# EAGLE design GMO-Clone_PCB (EAGLE 9.2.2)
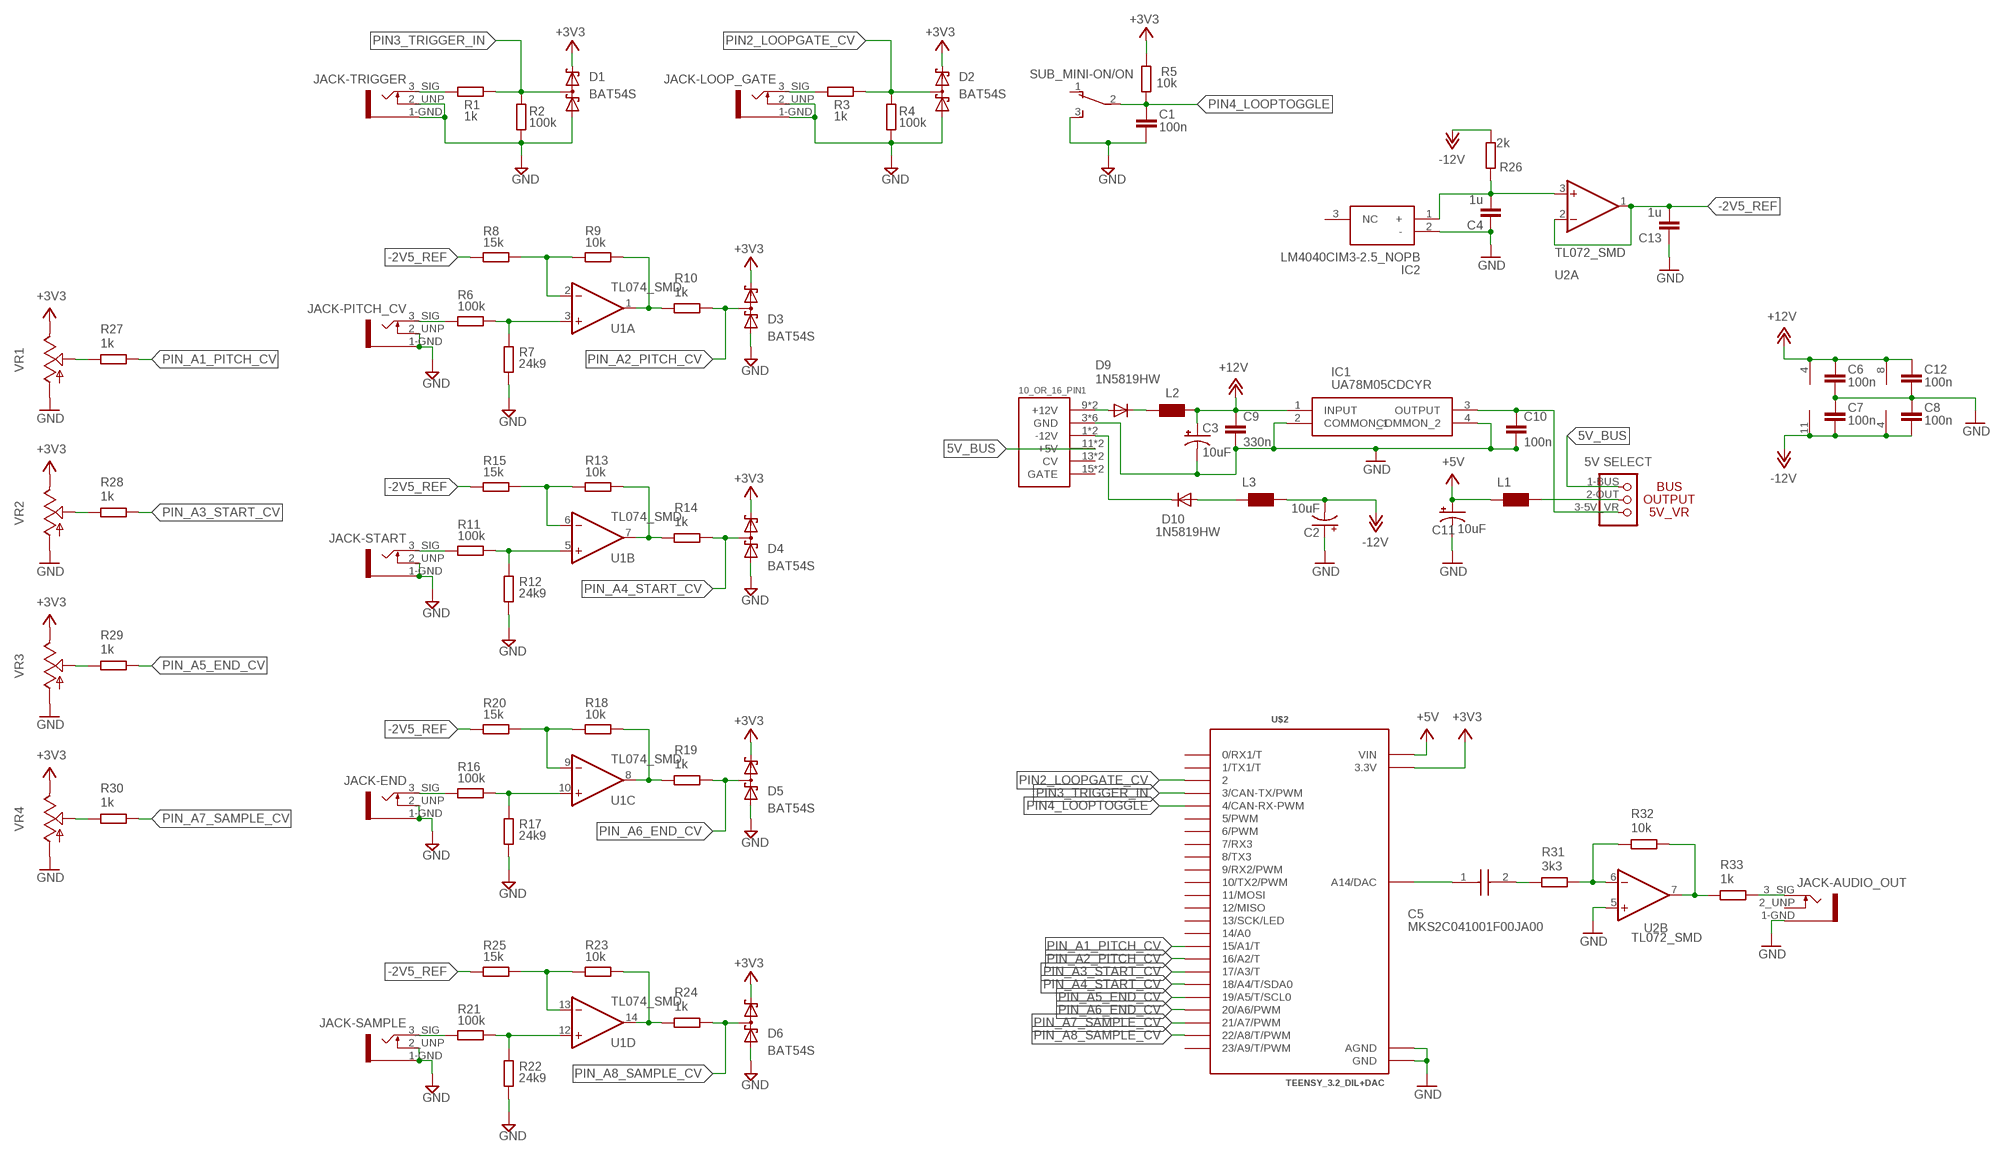
[diagram p0: schematic, sheet 1]

## Parts
10_OR_16_PIN1  POWER  [POWER_16]
C1  100n  C-EUC0603K  [C0603K]
C2  10uF  47UF-POLAR-PANASONIC_D-35V-20%  [PANASONIC_D]
C3  10uF  47UF-POLAR-PANASONIC_D-35V-20%  [PANASONIC_D]
C4  1u  C-EUC0603  [C0603]
C5  MKS2C041001F00JA00  [MKS2C041001F00JA00]
C6  100n  C-EUC0603K  [C0603K]
C7  100n  C-EUC0603K  [C0603K]
C8  100n  C-EUC0603K  [C0603K]
C9  330n  C-EUC0603  [C0603]
C10  100n  C-EUC0603  [C0603]
C11  10uF  47UF-POLAR-PANASONIC_D-35V-20%  [PANASONIC_D]
C12  100n  C-EUC0603K  [C0603K]
C13  1u  C-EUC0603  [C0603]
D1  BAT54S  [SOT23]
D2  BAT54S  [SOT23]
D3  BAT54S  [SOT23]
D4  BAT54S  [SOT23]
D5  BAT54S  [SOT23]
D6  BAT54S  [SOT23]
D9  1N5819HW  DIODE_DIODE-SOD123  [DIODE_SOD123]
D10  1N5819HW  DIODE_DIODE-SOD123  [DIODE_SOD123]
IC1  UA78M05CDCYR  [SOT230P700X180-4N]
IC2  LM4040CIM3-2.5_NOPB  [SOT95P237X112-3N]
JACK-AUDIO_OUT  MISC_JACKTHONK_PJ301M-12  [THONK_PJ301M-12]
JACK-END  MISC_JACKTHONK_PJ301M-12  [THONK_PJ301M-12]
JACK-LOOP_GATE  MISC_JACKTHONK_PJ301M-12  [THONK_PJ301M-12]
JACK-PITCH_CV  MISC_JACKTHONK_PJ301M-12  [THONK_PJ301M-12]
JACK-SAMPLE  MISC_JACKTHONK_PJ301M-12  [THONK_PJ301M-12]
JACK-START  MISC_JACKTHONK_PJ301M-12  [THONK_PJ301M-12]
JACK-TRIGGER  MISC_JACKTHONK_PJ301M-12  [THONK_PJ301M-12]
JP2  SELECTOR_POWER  [SELECTOR_POWER]
L1  WE-CBF_0603  [0603]
L2  WE-CBF_0603  [0603]
L3  WE-CBF_0603  [0603]
R1  1k  R-EU_R0603  [R0603]
R2  100k  R-EU_R0603  [R0603]
R3  1k  R-EU_R0603  [R0603]
R4  100k  R-EU_R0603  [R0603]
R5  10k  R-EU_R0603  [R0603]
R6  100k  R-EU_R0603  [R0603]
R7  24k9  R-EU_R0603  [R0603]
R8  15k  R-EU_R0603  [R0603]
R9  10k  R-EU_R0603  [R0603]
R10  1k  R-EU_R0603  [R0603]
R11  100k  R-EU_R0603  [R0603]
R12  24k9  R-EU_R0603  [R0603]
R13  10k  R-EU_R0603  [R0603]
R14  1k  R-EU_R0603  [R0603]
R15  15k  R-EU_R0603  [R0603]
R16  100k  R-EU_R0603  [R0603]
R17  24k9  R-EU_R0603  [R0603]
R18  10k  R-EU_R0603  [R0603]
R19  1k  R-EU_R0603  [R0603]
R20  15k  R-EU_R0603  [R0603]
R21  100k  R-EU_R0603  [R0603]
R22  24k9  R-EU_R0603  [R0603]
R23  10k  R-EU_R0603  [R0603]
R24  1k  R-EU_R0603  [R0603]
R25  15k  R-EU_R0603  [R0603]
R26  2k  R-EU_R0603  [R0603]
R27  1k  R-EU_R0603  [R0603]
R28  1k  R-EU_R0603  [R0603]
R29  1k  R-EU_R0603  [R0603]
R30  1k  R-EU_R0603  [R0603]
R31  3k3  R-EU_R0603  [R0603]
R32  10k  R-EU_R0603  [R0603]
R33  1k  R-EU_R0603  [R0603]
SUB_MINI-ON/ON  TL36PO  [TL3XPO]
U1  TL074_SMD  [SO14]
U2  TL072_SMD  [SO08]
U$2  TEENSY_3.2_DIL+DAC  [TEENSY_3.2_DIL+DAC]
VR1  9MM_SNAP-IN_POT_  [9MM_SNAP-IN_POT]
VR2  9MM_SNAP-IN_POT_  [9MM_SNAP-IN_POT]
VR3  9MM_SNAP-IN_POT_  [9MM_SNAP-IN_POT]
VR4  9MM_SNAP-IN_POT_  [9MM_SNAP-IN_POT]

## Nets
5V_BUS: 10_OR_16_PIN1.11(+5V) 10_OR_16_PIN1.12(+5V) JP2.1-BUS
+3V3 [power]: D1.2(C2) D2.2(C2) D3.2(C2) D4.2(C2) D5.2(C2) D6.2(C2) R5.2 U$2.3.3V VR1.3(E) VR2.3(E) VR3.3(E) VR4.3(E)
+5V [power]: C11.+ L1.1 U$2.VIN
+12V [power]: C3.+ C6.1 C9.1 C12.1 IC1.1(INPUT) L2.2 U1.4(P:V+) U2.8(P:V+)
-2V5_REF [power]: C13.2 R8.1 R15.1 R20.1 R25.1 U2.1(A:OUT) U2.2(A:-IN)
-12V [power]: C2.- C7.2 C8.2 L3.2 R26.2 U1.11(P:V-) U2.4(P:V-)
GND [power]: 10_OR_16_PIN1.3(GND) 10_OR_16_PIN1.4(GND) 10_OR_16_PIN1.5(GND) 10_OR_16_PIN1.6(GND) 10_OR_16_PIN1.7(GND) 10_OR_16_PIN1.8(GND) C1.2 C2.+ C3.- C4.1 C6.2 C7.1 C8.1 C9.2 C10.2 C11.- C12.2 C13.1 D1.1(A1) D2.1(A1) D3.1(A1) D4.1(A1) D5.1(A1) D6.1(A1) IC1.2(COMMON_1) IC1.4(COMMON_2) IC2.2(-) JACK-AUDIO_OUT.1-GND JACK-END.1-GND JACK-END.2_UNP(2-UNPLUGGED) JACK-LOOP_GATE.1-GND JACK-LOOP_GATE.2_UNP(2-UNPLUGGED) JACK-PITCH_CV.1-GND JACK-PITCH_CV.2_UNP(2-UNPLUGGED) JACK-SAMPLE.1-GND JACK-SAMPLE.2_UNP(2-UNPLUGGED) JACK-START.1-GND JACK-START.2_UNP(2-UNPLUGGED) JACK-TRIGGER.1-GND JACK-TRIGGER.2_UNP(2-UNPLUGGED) R2.1 R4.1 R7.1 R12.1 R17.1 R22.1 SUB_MINI-ON/ON.3(S) U2.5(B:+IN) U$2.AGND U$2.GND VR1.1(A) VR2.1(A) VR3.1(A) VR4.1(A)
N$1: JACK-LOOP_GATE.3_SIG(3-SIGNAL_IN_OUT) R3.1
N$2: JACK-TRIGGER.3_SIG(3-SIGNAL_IN_OUT) R1.1
N$3: JACK-PITCH_CV.3_SIG(3-SIGNAL_IN_OUT) R6.1
N$4: R9.1 R10.2 U1.1(A:OUT)
N$5: R8.2 R9.2 U1.2(A:-IN)
N$6: JACK-START.3_SIG(3-SIGNAL_IN_OUT) R11.1
N$7: R6.2 R7.2 U1.3(A:+IN)
N$8: R13.1 R14.2 U1.7(B:OUT)
N$9: R13.2 R15.2 U1.6(B:-IN)
N$10: R11.2 R12.2 U1.5(B:+IN)
N$11: JACK-END.3_SIG(3-SIGNAL_IN_OUT) R16.1
N$12: R18.1 R19.2 U1.8(C:OUT)
N$13: R18.2 R20.2 U1.9(C:-IN)
N$14: R16.2 R17.2 U1.10(C:+IN)
N$15: JACK-SAMPLE.3_SIG(3-SIGNAL_IN_OUT) R21.1
N$16: R23.1 R24.2 U1.14(D:OUT)
N$17: R23.2 R25.2 U1.13(D:-IN)
N$18: R21.2 R22.2 U1.12(D:+IN)
N$19: R27.2 VR1.2(S)
N$20: R28.2 VR2.2(S)
N$21: R29.2 VR3.2(S)
N$22: R30.2 VR4.2(S)
N$23: C10.1 IC1.3(OUTPUT) JP2.3-5V_VR(3-VR)
N$24: 10_OR_16_PIN1.9(+12V) 10_OR_16_PIN1.10(+12V) D9.A
N$25: C5.1 U$2.RESET/DAC(A14/DAC)
N$26: 10_OR_16_PIN1.1(-12V) 10_OR_16_PIN1.2(-12V) D10.C
N$27: C4.2 IC2.1(+) R26.1 U2.3(A:+IN)
N$28: C5.2 R31.2
N$29: R31.1 R32.2 U2.6(B:-IN)
N$30: R32.1 R33.2 U2.7(B:OUT)
N$31: JACK-AUDIO_OUT.3_SIG(3-SIGNAL_IN_OUT) R33.1
N$32: JP2.2-OUT L1.2
N$33: D9.C L2.1
N$34: D10.A L3.1
PIN2_LOOPGATE_CV: D2.3(C1A2) R3.2 R4.2 U$2.2
PIN3_TRIGGER_IN: D1.3(C1A2) R1.2 R2.2 U$2.3(3/CAN-TX/PWM)
PIN4_LOOPTOGGLE: C1.1 R5.1 SUB_MINI-ON/ON.2(P) U$2.4(4/CAN-RX-PWM)
PIN_A1_PITCH_CV: R27.1 U$2.15/A1(15/A1/T)
PIN_A2_PITCH_CV: D3.3(C1A2) R10.1 U$2.16/A2(16/A2/T)
PIN_A3_START_CV: R28.1 U$2.17/A3(17/A3/T)
PIN_A4_START_CV: D4.3(C1A2) R14.1 U$2.18/A4(18/A4/T/SDA0)
PIN_A5_END_CV: R29.1 U$2.19/A5(19/A5/T/SCL0)
PIN_A6_END_CV: D5.3(C1A2) R19.1 U$2.20/A6(20/A6/PWM)
PIN_A7_SAMPLE_CV: R30.1 U$2.21/A7(21/A7/PWM)
PIN_A8_SAMPLE_CV: D6.3(C1A2) R24.1 U$2.22/A8(22/A8/T/PWM)
Unconnected: 10_OR_16_PIN1.13(CV) 10_OR_16_PIN1.14(CV) 10_OR_16_PIN1.15(GATE) 10_OR_16_PIN1.16(GATE) IC2.3(NC) JACK-AUDIO_OUT.2_UNP(2-UNPLUGGED) SUB_MINI-ON/ON.1(O) U$2.0(0/RX1/T) U$2.1(1/TX1/T) U$2.5(5/PWM) U$2.6(6/PWM) U$2.7(7/RX3) U$2.8(8/TX3) U$2.9(9/RX2/PWM) U$2.10(10/TX2/PWM) U$2.11(11/MOSI) U$2.12(12/MISO) U$2.13(13/SCK/LED) U$2.14/A0 U$2.23/A9(23/A9/T/PWM)

## Library data of the parts
10_OR_16_PIN1 = eurorack:POWER
C1 C4 C6-C10 C12 C13 = resistor:C-EU: CAPACITOR, European symbol
C2 C3 C11 = SparkFun-Capacitors:47UF-POLAR: 47µF polarized capacitors A capacitor is a passive two-terminal electrical component used to store electrical energy temporarily in an electric field.; PROD_ID: CAP-08478; VALUE: 47uF
C5 = SamacSys_Parts:MKS2C041001F00JA00: Film Capacitors 1.0 uF 63 VDC 5% Source: Datasheet <https://componentsearchengine.com/Datasheets/1/MKS2C041001F00JA00.pdf>; DESCRIPTION: Film Capacitors 1.0 uF 63 VDC 5%; HEIGHT: 10mm; MANUFACTURER_NAME: WIMA; MANUFACTURER_PART_NUMBER: MKS2C041001F00JA00; MOUSER_PART_NUMBER: 505-MKS2C041001F00JA; MOUSER_PRICE-STOCK: https://www.mouser.com/Search/Refine.aspx?Keyword=505-MKS2C041001F00JA
D1-D6 = diode:BAT54S: Schottky Diodes Pin connection corrected 2011-05-04 Source: Fairchild .. BAT54.pdf
D9 D10 = grids_v02:DIODE_DIODE-: DIODE
IC1 = SamacSys_Parts:UA78M05CDCYR: 500-mA, 25-V, Linear Voltage Regulators Source: Datasheet <http://www.ti.com/lit/gpn/ua78m>; DESCRIPTION: 500-mA, 25-V, Linear Voltage Regulators; HEIGHT: 1.8mm; MANUFACTURER_NAME: Texas Instruments; MANUFACTURER_PART_NUMBER: UA78M05CDCYR; MOUSER_PART_NUMBER: 595-UA78M05CDCYR; MOUSER_PRICE-STOCK: https://www.mouser.com/Search/Refine.aspx?Keyword=595-UA78M05CDCYR
IC2 = SamacSys_Parts:LM4040CIM3-2.5_NOPB: 100-ppm/C precision micropower shunt voltage reference Source: Datasheet <http://www.ti.com/lit/ds/symlink/lm4040-n.pdf>; DESCRIPTION: 100-ppm/C precision micropower shunt voltage reference; HEIGHT: 1.12mm; MANUFACTURER_NAME: Texas Instruments; MANUFACTURER_PART_NUMBER: LM4040CIM3-2.5/NOPB; MOUSER_PART_NUMBER: 926-LM4040CIM325NOPB; MOUSER_PRICE-STOCK: https://www.mouser.com/Search/Refine.aspx?Keyword=926-LM4040CIM325NOPB; RS_PART_NUMBER: 5359600P; RS_PRICE-STOCK: http://uk.rs-online.com/web/p/products/5359600P
JACK-AUDIO_OUT JACK-END JACK-LOOP_GATE JACK-PITCH_CV JACK-SAMPLE JACK-START JACK-TRIGGER = SchnitzelsComponents:MISC_JACK: 3.5mm Mono Switching Jack Part-Nr.: PJ301BM Supplier: - www.Thonk.uk Link to Jacks @ Thonk.uk <https://www.thonk.co.uk/shop/3-5mm-jacks/>
JP2 = SchnitzelsComponents:SELECTOR_POWER: PIN HEADER
L1-L3 = wuerth-elektronik:WE-CBF: SMD EMI Suppression Ferrite Beads - excellent anti-EMI properties - low DCR - impedances till 3000 ohms - rated current up to 6 A
R1-R33 = resistor:R-EU_: RESISTOR, European symbol
SUB_MINI-ON/ON = switch:TL36PO: TINY SWITCH ON - ON Source: http://www2.produktinfo.conrad.com/datenblaetter/700000-724999/705152-da-01-de-Subminiaturschalter_TL_36YO.pdf
U1 = MusicThingModular:TL074: Generic Quad Op Amp
U2 = MusicThingModular:TL072: Generic Dual Op Amp
U$2 = SchnitzelsComponents:TEENSY_3.2_DIL+DAC: Footprint for Teensy 3.1 or 3.2 board using all pin connections on the outer perimeter
VR1-VR4 = MusicThingModular:9MM_SNAP-IN_POT: 9mm vertical snap-in pot, Alpha / Panasonic style

## Net classes
0 default: width 0.305 mm, clearance 0.305 mm
1 power: width 0.508 mm, clearance 0.508 mm

## Board
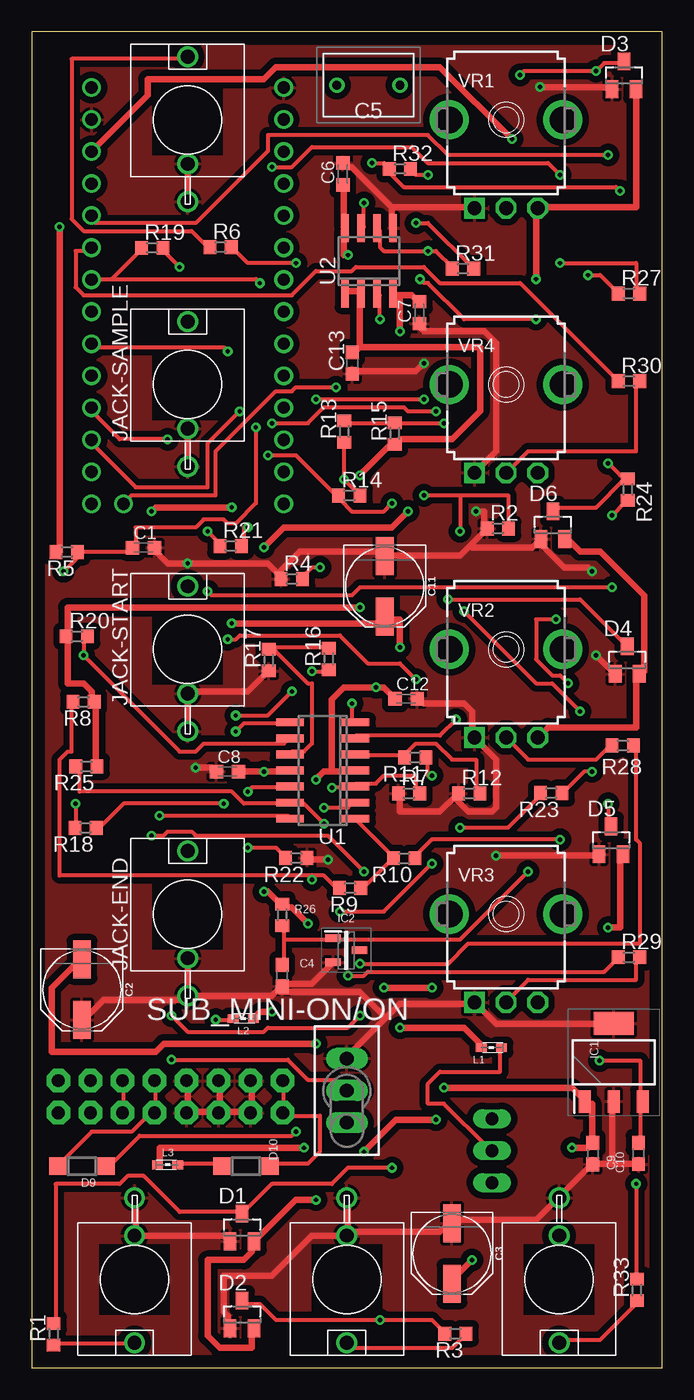
[diagram p1: board, top side]
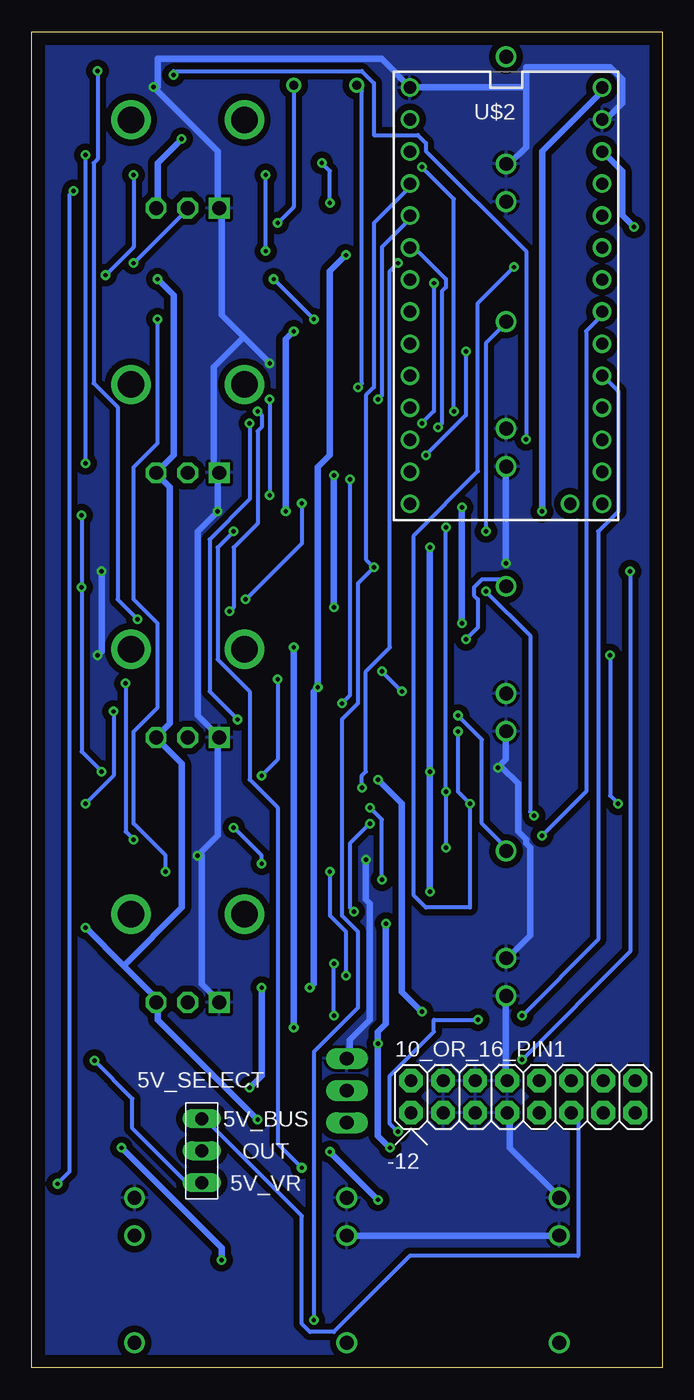
[diagram p2: board, bottom side, seen from below]

Size 50 x 106 mm. Coordinates in mm from the lower left corner, seen from the top.
Outline: 0,0 50,0 50,106 0,106 0,0
Copper layers (1*16): Top 0.035mm / dielectric 1.5mm / Bottom 0.035mm
Design rules "default": minimum track width 6mil, minimum drill 0.35mm, track to track 6mil, track to pad 6mil, pad to pad 6mil, via to via 6mil, smd to smd 6mil, copper to edge 40mil, drill to drill 6mil, minimum pad ring 10mil, minimum via ring 8mil, stop-mask expansion 4mil, vias tented up to drill 0mil, thermal gap 10mil

### Footprints (pad centres in the part's own frame; a part is rotated, then mirrored left to right if it is on the bottom)
POWER_16 = drill 1.016 pad 1.88 octagon: 1 -6.35,-1.27; 2 -6.35,1.27; 3 -3.81,-1.27; 4 -3.81,1.27; 5 -1.27,-1.27; 6 -1.27,1.27; 7 1.27,-1.27; 8 1.27,1.27; 9 3.81,-1.27; 10 3.81,1.27; 11 6.35,-1.27; 12 6.35,1.27; 13 8.89,-1.27; 14 8.89,1.27; 15 11.43,-1.27; 16 11.43,1.27
C0603K = smd 1.05 x 1.08: 1 -0.875,0; 2 0.875,0
PANASONIC_D = smd 3 x 1.4: + 2.4,0; - -2.4,0
C0603 = smd 1.1 x 1: 1 -0.85,0; 2 0.85,0
MKS2C041001F00JA00 = drill 0.7 pad 1.2: 1 0,0; 2 5,0
SOT23 = smd 1 x 1.4: 1 -0.95,-1.1; 2 0.95,-1.1; 3 0,1.1
DIODE_SOD123 = smd 1.4 x 1.4: A 1.9,0; C -1.9,0
SOT230P700X180-4N = smd 1.8 x 0.95: 1 -3.1,2.3; 2 -3.1,0; 3 -3.1,-2.3 | smd 1.8 x 3.2: 4 3.1,0
SOT95P237X112-3N = smd 1.25 x 0.6: 1 -1.05,0.95; 2 -1.05,-0.95; 3 1.05,0
THONK_PJ301M-12 = drill 1.1: 1-GND 0,-6.5; 2_UNP 0,-3.5; 3_SIG 0,5
SELECTOR_POWER = drill 1.016 long: 1-BUS 0,5.08; 2-OUT 0,2.54; 3-5V_VR 0,0
0603 = smd 0.85 x 0.7: 1 -0.9,0; 2 0.7,0
R0603 = smd 1 x 1.1: 1 -0.85,0; 2 0.85,0
TL3XPO = drill 1.1 pad 1.422 long: 1 -2.54,0; 2 0,0; 3 2.54,0
SO14 = smd 0.6 x 2.2: 1 -3.81,-2.6; 2 -2.54,-2.6; 3 -1.27,-2.6; 4 0,-2.6; 5 1.27,-2.6; 6 2.54,-2.6; 7 3.81,-2.6; 8 3.81,2.6; 9 2.54,2.6; 10 1.27,2.6; 11 0,2.6; 12 -1.27,2.6; 13 -2.54,2.6; 14 -3.81,2.6
SO08 = smd 0.6 x 2.2: 1 -1.905,-2.6; 2 -0.635,-2.6; 3 0.635,-2.6; 4 1.905,-2.6; 5 1.905,2.6; 6 0.635,2.6; 7 -0.635,2.6; 8 -1.905,2.6
TEENSY_3.2_DIL+DAC = drill 0.965: 0 -7.62,13.97; 1 -7.62,11.43; 2 -7.62,8.89; 3 -7.62,6.35; 3.3V 7.62,11.43; 4 -7.62,3.81; 5 -7.62,1.27; 6 -7.62,-1.27; 7 -7.62,-3.81; 8 -7.62,-6.35; 9 -7.62,-8.89; 10 -7.62,-11.43; 11 -7.62,-13.97; 12 -7.62,-16.51; 13 7.62,-16.51; 14/A0 7.62,-13.97; 15/A1 7.62,-11.43; 16/A2 7.62,-8.89; 17/A3 7.62,-6.35; 18/A4 7.62,-3.81; 19/A5 7.62,-1.27; 20/A6 7.62,1.27; 21/A7 7.62,3.81; 22/A8 7.62,6.35; 23/A9 7.62,8.89; AGND 7.62,13.97; GND -7.62,16.51; RESET/DAC 5.08,-16.51; VIN 7.62,16.51
9MM_SNAP-IN_POT = drill 1.1 square: 1 -2.5,-7 | drill 1.1 octagon: 2 0,-7; 3 2.5,-7 | drill 2.1 pad 2.794: CHASSIS1 -4.5,0; CHASSIS2 4.5,0

### Placement (x,y rotation side)
10_OR_16_PIN1  13.56,21.52 0 bottom
C1  8.88,65.07 0 top
C2  4,30 270 top
C3  33.34,9.08 270 top
C4  19.87,31.13 90 top
C5  24.21,101.75 0 top
C6  24.68,94.7 90 top
C7  30.76,83.7 90 top
C8  15.53,47.3 0 top
C9  44.5,17 270 top
C10  48.12,17.02 270 top
C11  28,62 270 top
C12  29.7,53.08 0 top
C13  25.43,79.7 90 top
D1  16.7,11.15 0 top
D2  16.7,4.25 0 top
D3  46.98,102.52 0 top
D4  47.23,56.15 0 top
D5  45.95,41.85 0 top
D6  41.33,66.85 0 top
D9  4,16 180 top
D10  17,16 180 top
IC1  46.16,24.23 90 top
IC2  24.95,33.13 0 top
JACK-AUDIO_OUT  41.83,7 180 top
JACK-END  12.38,36 0 top
JACK-LOOP_GATE  25,7 180 top
JACK-PITCH_CV  12.38,99 0 top
JACK-SAMPLE  12.38,78 0 top
JACK-START  12.38,57 0 top
JACK-TRIGGER  8.17,7 180 top
JP2  36.51,14.69 0 bottom
L1  36.56,25.41 0 top
L2  16.89,27.71 0 top
L3  10.69,16.12 180 top
R1  1.75,2.68 90 top
R2  36.98,66.58 0 top
R3  33.61,2.72 180 top
R4  20.63,62.58 0 top
R5  2.8,64.72 180 top
R6  14.99,88.9 0 top
R7  29.93,45.58 0 top
R8  4.13,52.84 180 top
R9  25.26,38.07 180 top
R10  29.55,40.43 180 top
R11  30.42,48.42 180 top
R12  34.71,45.58 0 top
R13  24.8,74.28 90 top
R14  25.2,69.2 0 top
R15  28.8,74.12 90 top
R16  23.56,56.24 90 top
R17  18.8,56.14 90 top
R18  4.29,42.84 180 top
R19  9.56,88.84 0 top
R20  3.6,58.03 0 top
R21  15.79,65.2 0 top
R22  20.99,40.45 180 top
R23  41.21,45.59 180 top
R24  47.28,69.67 270 top
R25  4.35,47.72 180 top
R26  19.87,35.94 90 top
R27  47.37,85.22 0 top
R28  46.88,49.37 180 top
R29  47.37,32.58 0 top
R30  47.37,78.26 0 top
R31  34.21,87.18 0 top
R32  29.21,95.1 0 top
R33  48,6.19 90 top
SUB_MINI-ON/ON  25,22 90 top
U1  23.09,47.39 90 top
U2  26.75,87.8 0 top
U$2  12.38,85.05 0 bottom
VR1  37.62,99 0 top
VR2  37.62,57 0 top
VR3  37.62,36 0 top
VR4  37.62,78 0 top

### Tracks (layer width: path | path; a pad name or v marks a point on that pad's centre or on a via)
5V_BUS
  Top 0.305: 10_OR_16_PIN1.12 7.3,22.54 7.3,20.32 10_OR_16_PIN1.11
  Bottom 0.305: JP2.1-BUS 36.2,19.68 28.57,12.06 28.57,3.49 27.94,2.86 26.04,2.86 20,8.89 6.67,8.89 6.67,19.68 6.99,20 10_OR_16_PIN1.11
+3V3  (via drill 0.35)
  Top 0.508: D2.2 17.46,2.86 17.46,1.59 14.92,1.59 13.97,2.54 13.97,8.57 16.83,8.57 17.46,9.21 17.46,9.84 D1.2 17.78,10.16 20.95,13.34 v22.54,13.34 | v45.72,34.92 46.67,34.92 46.67,40.64 D5.2 | v26.35,17.14 28.89,19.68 v32.07,19.68 | v2.22,90.49 2.22,64.77 R5.2 | D3.2 47.94,101.28 47.94,92.08 40.32,92.08 VR1.3 40.01,91.76 v40.01,86.36 | VR2.3 40.32,50.16 40.96,50.8 47.94,50.8 47.94,54.93 D4.2 48.26,55.24 48.58,55.24 48.58,61.28 45.09,64.77 43.5,64.77 42.55,65.72 D6.2 | v38.1,97.47 32.38,103.19 19.37,103.19 18.41,102.23 9.21,102.23 9.21,100.97 4.76,96.52 U$2.3.3V
  Bottom 0.508: 42.7,31.91 40.32,29.53 40.32,29.21 VR3.3 40.01,28.89 40.01,27.62 v32.07,19.68 | 42.7,31.91 v45.72,34.92 | v26.35,17.14 v22.54,13.34 | v2.22,90.49 3.17,91.44 3.17,94.93 4.45,96.2 U$2.3.3V | v40.01,86.36 38.73,85.09 38.73,72.39 VR4.3 40.01,70.8 39.05,69.85 39.05,51.12 40.01,50.16 VR2.3 40.01,49.85 38.1,47.94 38.1,36.51 42.7,31.91 | v38.1,97.47 40.01,95.57 40.01,92.08 VR1.3
+5V  (via drill 0.35)
  Top 0.508: v29.21,26.99 34.29,26.99 35.56,25.72 L1.1 | 29.21,59.05 29.21,59.37 28.26,59.37 C11.+ | 29.21,59.05 v29.21,57.15 | v9.53,67.94 9.84,68.26 v15.88,68.26 | 29.21,59.05 v15.88,59.05
  Bottom 0.508: v29.21,57.15 v29.21,26.99 | v9.53,67.94 9.53,96.52 4.76,101.28 U$2.VIN | v15.88,59.05 v15.88,68.26
+12V  (via drill 0.35)
  Top 0.508: v42.86,17.46 44.13,17.46 44.45,17.78 C9.1 44.45,18.1 44.45,20.95 44.13,20.95 IC1.1 43.81,21.27 42.86,22.23 v32.7,22.23 | v34.92,8.57 33.34,6.99 C3.+ | C6.1 24.77,93.66 24.77,90.49 U2.8 24.77,90.17 24.77,88.27 v25.08,88.27 | v19.05,28.26 18.1,28.26 17.78,27.94 L2.2 | v22.54,46.67 23.18,47.31 23.81,47.31 | 23.81,47.31 25.4,47.31 U1.4 | 23.81,47.31 23.81,53.02 24.77,53.98 v27.3,53.98 27.94,53.98 28.57,53.34 C12.1 | v27.94,30.16 v31.75,30.16
  Bottom 0.508: v42.86,17.46 34.92,9.53 v34.92,8.57 | v19.05,28.26 20.64,29.84 20.64,44.77 v22.54,46.67 | v25.08,88.27 26.35,87 26.35,72.39 27.3,71.44 v27.3,53.98 27.62,53.66 27.62,30.48 v27.94,30.16 | v32.7,22.23 31.75,23.18 v31.75,30.16
-2V5_REF  (via drill 0.35)
  Top 0.508: R25.1 5.08,47.94 5.08,52.7 R8.1 4.76,53.02 4.76,53.66 4.13,54.29 2.86,54.29 2.86,57.78 R20.1 2.86,58.1 2.86,60.33 v26.04,60.33 | U2.1 25.08,85.41 26.04,85.41 U2.2 26.04,85.09 26.04,80.96 | 26.04,80.96 35.56,80.96 35.56,75.88 33.34,73.66 29.21,73.66 28.89,73.34 R15.1 28.57,73.03 28.26,73.03 v26.04,70.8 | 26.04,80.96 25.72,80.64 C13.2
  Bottom 0.508: v26.04,70.8 v26.04,60.33
-12V  (via drill 0.35)
  Top 0.508: v21.59,17.46 10.16,17.46 10.16,16.19 L3.2 | v21.91,35.24 20.64,36.51 20,36.51 R26.2 19.68,36.83 18.73,37.78 v18.41,37.78 | v22.54,25.72 10.48,25.72 9.84,25.08 1.59,25.08 1.59,30.16 3.81,32.38 C2.- | 29.21,85.09 28.89,85.09 U2.4 | 29.21,85.09 30.16,85.09 30.48,84.77 C7.2 | C8.2 16.51,47.31 v18.41,47.31 20.32,47.31 U1.11 | v29.21,82.23 29.21,85.09 | v29.84,67.94 28.57,66.67 20,66.67 v18.41,65.09
  Bottom 0.508: v21.59,17.46 22.54,18.41 v22.54,25.72 22.54,26.67 21.91,27.3 v21.91,35.24 | v29.21,82.23 29.84,81.6 v29.84,67.94 | v18.41,65.09 v18.41,47.31 v18.41,37.78
GND  (via drill 0.35)
  Top 0.508: JACK-SAMPLE.1-GND 12.38,71.75 12.38,74.3 JACK-SAMPLE.2_UNP | 19.53,63.02 19.68,62.87 R4.1 | 19.53,63.02 18.73,63.82 v12.38,63.82 10.79,63.82 9.84,64.77 C1.2 | 34.77,65.25 33.97,64.45 28.26,64.45 C11.- 27.94,64.45 27.62,64.77 21.27,64.77 19.53,63.02 | 34.77,65.25 35.88,66.36 R2.1 35.88,66.67 35.88,67.94 v35.24,67.94 | 34.77,65.25 34.92,65.09 39.69,65.09 40.32,65.72 D6.1 40.32,65.41 42.23,63.5 44.13,63.5 v44.45,63.18 | v44.77,56.52 46.04,55.24 D4.1 | JACK-PITCH_CV.1-GND 12.38,92.71 12.38,95.25 JACK-PITCH_CV.2_UNP | C7.1 30.8,82.55 31.11,82.23 35.88,82.23 36.83,81.28 36.83,72.71 35.24,71.12 VR4.1 | 28.57,92.08 25.4,95.25 25.08,95.25 24.77,95.57 C6.2 | 28.57,92.08 28.57,90.49 U2.5 | v31.11,79.69 30.48,79.06 25.72,79.06 C13.1 | v40.32,101.6 45.72,101.6 D3.1 | 28.57,92.08 34.92,92.08 VR1.1 | v23.5,40.32 21.91,40.32 R22.1 | IC1.4 46.04,27.3 36.83,27.3 35.24,28.89 VR3.1 34.92,28.89 29.21,28.89 28.1,27.78 | R7.1 29.21,45.4 29.21,44.13 32.38,44.13 33.66,45.4 R12.1 33.66,45.09 34.61,44.13 36.51,44.13 36.83,44.45 36.83,48.26 35.24,49.85 VR2.1 34.92,50.16 34.92,52.07 34.29,52.7 31.11,52.7 30.8,53.02 C12.2 | v36.83,40.64 44.77,40.64 D5.1 | 28.1,27.78 25.08,24.77 SUB_MINI-ON/ON.3 | 46.04,16.19 47.94,16.19 C10.2 | 46.04,16.19 44.77,16.19 C9.2 44.45,15.88 44.13,15.88 41.91,13.65 JACK-AUDIO_OUT.1-GND 41.59,13.34 40.01,11.75 33.34,11.75 C3.- 33.02,11.43 32.38,10.79 25.08,10.79 | 46.04,16.19 46.04,20.95 IC1.2 | D2.1 15.56,3.17 15.56,4.13 15.24,4.45 15.24,7.3 19.05,7.3 22.23,10.48 24.77,10.48 JACK-LOOP_GATE.2_UNP 25.08,10.79 | 25.08,10.79 25.08,13.34 JACK-LOOP_GATE.1-GND
  Top 0.508: v13.02,47.62 14.29,47.62 14.61,47.31 C8.1 | R17.1 18.73,55.24 17.14,53.66 12.38,53.66 JACK-START.2_UNP 12.38,53.34 12.38,50.8 JACK-START.1-GND | D1.1 15.56,10.16 15.24,10.48 8.26,10.48 JACK-TRIGGER.2_UNP 8.26,10.79 8.26,13.34 JACK-TRIGGER.1-GND | 10_OR_16_PIN1.4 17.46,22.54 17.46,20.32 10_OR_16_PIN1.3 17.14,20.32 14.92,20.32 | 12.38,20.32 12.38,22.54 10_OR_16_PIN1.8 | 14.92,20.32 14.92,22.54 10_OR_16_PIN1.6 | 12.38,20.32 14.61,20.32 10_OR_16_PIN1.5 14.92,20.32 | 12.38,20.32 10_OR_16_PIN1.7 | 12.38,29.53 19.05,29.53 19.68,30.16 C4.1 | IC2.2 23.81,32.07 22.23,30.48 20,30.48 C4.1 | C2.+ 4.13,27.62 5.71,29.21 12.06,29.21 JACK-END.1-GND 12.38,29.53 | 12.38,29.53 12.38,32.38 JACK-END.2_UNP | 28.1,27.78 26.04,29.84 19.68,29.84 C4.1
  Bottom 0.508: v12.38,63.82 12.38,71.44 JACK-SAMPLE.1-GND | v44.77,56.52 44.45,56.83 v44.45,63.18 | 10.79,101.6 10.79,96.84 12.06,95.57 JACK-PITCH_CV.2_UNP | 10.79,101.6 10.79,103.19 4.13,103.19 3.17,102.23 3.17,100.33 4.45,99.06 U$2.AGND | 10.79,101.6 19.68,101.6 U$2.GND 20,101.6 22.23,103.82 40.01,103.82 40.01,101.6 v40.32,101.6 35.24,96.52 35.24,92.08 VR1.1 34.92,91.76 34.92,83.5 33.18,81.76 | 33.18,81.76 v31.11,79.69 | 33.18,81.76 35.56,79.38 35.56,71.44 35.24,71.12 VR4.1 35.24,70.8 v35.24,67.94 36.83,66.36 36.83,51.75 35.24,50.16 VR2.1 35.24,49.85 35.24,42.23 v36.83,40.64 36.51,40.64 36.51,30.48 35.24,29.21 VR3.1 | v23.5,40.32 23.5,37.15 23.18,36.83 23.18,27.62 24.77,26.04 24.77,24.77 SUB_MINI-ON/ON.3 | JACK-START.1-GND 12.38,50.48 12.38,48.26 v13.02,47.62 12.7,47.62 11.43,46.35 11.43,42.55 10.79,41.91 10.79,41.59 10.48,41.27 10.48,34.29 12.06,32.7 JACK-END.2_UNP | 10_OR_16_PIN1.8 12.38,22.86 12.38,29.21 JACK-END.1-GND | JACK-TRIGGER.1-GND 8.26,13.65 12.06,17.46 12.06,20 10_OR_16_PIN1.7 | JACK-LOOP_GATE.2_UNP 24.77,10.48 8.26,10.48 JACK-TRIGGER.2_UNP
  pour Top: 1,105 49,105 49,1 1,1
  pour Bottom: 1,105 49,105 49,1 1,1
N$1
  Top 0.305: R3.1 34.29,2.54 33.34,1.59 25.4,1.59 25.08,1.91 JACK-LOOP_GATE.3_SIG
N$2
  Top 0.305: R1.1 1.91,1.91 7.94,1.91 JACK-TRIGGER.3_SIG
N$3
  Top 0.305: R6.1 13.97,88.9 12.7,90.17 4.13,90.17 3.17,91.12 3.17,103.82 12.06,103.82 JACK-PITCH_CV.3_SIG
N$4
  Top 0.305: R9.1 26.35,38.1 28.57,40.32 R10.2 28.57,40.64 25.72,43.5 U1.1
N$5  (via drill 0.35)
  Top 0.305: 22.23,39.05 23.18,39.05 24.13,38.1 R9.2 | 22.23,39.05 2.22,39.05 2.22,48.26 2.86,48.9 3.17,48.9 3.17,52.7 R8.2 | v23.18,44.45 25.08,44.45 25.4,44.77 U1.2 | 22.23,39.05 v22.23,38.73
  Bottom 0.305: v23.18,44.45 22.23,43.5 v22.23,38.73
N$6  (via drill 0.35)
  Top 0.305: v31.75,46.99 31.43,46.99 31.43,48.26 R11.1 | v30.48,54.61 29.21,55.88 26.67,55.88 24.45,58.1 16.51,58.1 16.19,57.78 v15.56,57.78
  Bottom 0.305: v31.75,46.99 30.48,48.26 v30.48,54.61 | v15.56,57.78 14.61,58.74 14.61,60.96 14.92,61.28 14.92,61.91 14.29,62.55 12.38,62.55 12.38,62.23 JACK-START.3_SIG
N$7  (via drill 0.35)
  Top 0.305: v20.95,87.63 17.14,87.63 15.88,88.9 R6.2 | v23.81,46.04 25.4,46.04 U1.3 25.72,46.35 27.3,46.35 27.94,46.99 30.48,46.99 30.48,45.72 R7.2
  Bottom 0.305: v20.95,87.63 21.59,87 21.59,57.15 23.5,55.24 23.5,47.31 23.81,46.99 v23.81,46.04
N$8  (via drill 0.35)
  Top 0.305: R14.2 v24.77,70.48 24.77,73.34 R13.1 | v25.4,52.7 25.4,51.44 U1.7
  Bottom 0.305: v25.4,52.7 24.77,53.34 v24.77,70.48
N$9  (via drill 0.35)
  Top 0.305: R13.2 25.08,74.93 28.57,74.93 R15.2 28.89,74.93 v32.7,74.93 | v33.66,51.44 32.38,50.16 25.72,50.16 U1.6
  Bottom 0.305: v33.66,51.44 35.88,53.66 35.88,65.72 32.7,68.9 v32.7,74.93
N$10
  Top 0.305: 29.53,48.58 30.48,49.53 32.07,49.53 33.34,48.26 35.24,48.26 35.24,45.72 R12.2 | 29.53,48.58 25.72,48.58 U1.5 | 29.53,48.58 R11.2
N$11  (via drill 0.35)
  Top 0.305: v22.23,55.24 23.5,55.24 R16.1 | v20.64,53.66 18.73,51.75 v16.19,51.75
  Bottom 0.305: v20.64,53.66 v22.23,55.24 | v16.19,51.75 14.29,49.85 14.29,43.18 12.38,41.27 JACK-END.3_SIG
N$12  (via drill 0.35)
  Top 0.305: v15.24,44.77 7.3,44.77 5.4,42.86 R18.1 | v16.19,50.48 16.83,51.12 20.32,51.12 U1.8 | v11.75,87.31 10.48,88.58 R19.2
  Bottom 0.305: v16.19,50.48 16.19,45.72 v15.24,44.77 15.24,36.51 18.73,36.51 19.68,37.47 19.68,66.04 14.61,71.12 14.61,84.45 v11.75,87.31
N$13  (via drill 0.35)
  Top 0.305: v3.49,44.77 3.49,42.86 R18.2 | R20.2 4.45,57.78 4.13,57.78 v4.13,56.52 11.75,48.9 13.02,48.9 13.65,49.53 20,49.53 20.32,49.85 U1.9
  Bottom 0.305: v3.49,44.77 4.13,45.4 v4.13,56.52
N$14
  Top 0.305: R16.2 23.5,57.15 19.05,57.15 R17.2 19.05,56.83 19.37,56.83 21.91,54.29 22.23,54.29 22.23,49.53 21.59,48.9 20.64,48.9 U1.10
N$15  (via drill 0.35)
  Top 0.305: v13.97,66.36 14.92,65.41 R21.1
  Bottom 0.305: v13.97,66.36 13.97,81.28 12.38,82.87 JACK-SAMPLE.3_SIG
N$16  (via drill 0.35)
  Top 0.305: v44.45,47.31 43.81,47.31 42.23,45.72 R23.1 | v46.04,67.63 46.99,68.58 R24.2 | v10.16,43.81 20.32,43.81 U1.14 | v13.97,61.59 14.29,61.28 25.4,61.28 26.04,61.91 v46.04,61.91
  Bottom 0.305: v44.45,47.31 46.04,48.9 v46.04,61.91 v46.04,67.63 | v10.16,43.81 10.48,44.13 10.48,58.1 v13.97,61.59
N$17  (via drill 0.35)
  Top 0.305: R25.2 3.81,47.62 3.81,45.72 15.88,45.72 16.83,44.77 20.32,44.77 U1.13 20.64,44.77 21.59,44.77 v23.18,43.18 | v33.97,42.86 37.78,42.86 40.32,45.4 R23.2 | v31.75,40.01 27.94,36.2 v24.45,36.2
  Bottom 0.305: v33.97,42.86 31.75,40.64 v31.75,40.01 | v24.45,36.2 24.77,36.51 24.77,41.59 v23.18,43.18
N$18  (via drill 0.35)
  Top 0.305: v17.14,41.27 19.37,41.27 20,40.64 R22.2 | v17.14,45.72 17.46,46.04 20.32,46.04 U1.12 | v17.14,66.67 16.83,66.67 16.83,65.41 R21.2
  Bottom 0.305: v17.14,41.27 v17.14,45.72 v17.14,66.67
N$19  (via drill 0.35)
  Top 0.305: v41.91,87.63 47.94,87.63 47.94,85.41 R27.2
  Bottom 0.305: v41.91,87.63 37.78,91.76 VR1.2
N$20
  Top 0.305: R28.2 45.72,49.21 44.77,48.26 39.37,48.26 37.78,49.85 VR2.2
N$21
  Top 0.305: R29.2 47.94,32.38 47.94,30.8 39.37,30.8 37.78,29.21 VR3.2
N$22
  Top 0.305: R30.2 47.94,78.11 47.94,72.71 39.37,72.71 37.78,71.12 VR4.2
N$23  (via drill 0.35)
  Top 0.305: C10.1 48.26,18.1 48.26,20.95 IC1.3 48.26,21.27 48.26,24.38 v45.02,24.38
  Bottom 0.305: JP2.3-5V_VR 37.69,14.69 42,19 42,21.36 v45.02,24.38
N$24
  Top 0.305: D9.A 2.22,16.19 4.76,18.73 7.94,18.73 9.21,20 9.53,20 10_OR_16_PIN1.9 9.84,20.32 9.84,22.54 10_OR_16_PIN1.10
N$25  (via drill 0.35)
  Top 0.305: v24.13,77.79 20.95,77.79 20.64,77.47 19.37,77.47 14.61,72.71 14.61,69.22 7.94,69.22 7.3,68.58 U$2.RESET/DAC
  Bottom 0.305: v24.13,77.79 23.81,78.11 23.81,101.28 24.13,101.6 C5.1
N$26
  Top 0.305: D10.C 19.05,16.19 21.91,16.19 22.86,17.14 22.86,20 20,20 10_OR_16_PIN1.1 20,20.32 20,22.54 10_OR_16_PIN1.2
N$27  (via drill 0.35)
  Top 0.305: 20,33.97 20,34.92 R26.1 | 20,33.97 20,32.07 C4.2 | 20,33.97 23.81,33.97 IC2.1 24.13,33.97 33.97,33.97 v39.37,39.37 | v27.62,83.19 27.62,85.09 U2.3 | v30.8,86.36 31.11,86.04 31.43,86.04 34.29,83.19 v40.01,83.19
  Bottom 0.305: v30.8,86.36 v27.62,83.19 | v40.01,83.19 40.01,73.34 41.91,71.44 41.91,60.96 40.01,59.05 40.01,52.39 41.91,50.48 41.91,43.18 39.37,40.64 v39.37,39.37
N$28  (via drill 0.35)
  Top 0.305: v30.48,90.81 31.43,90.81 34.92,87.31 R31.2
  Bottom 0.305: v30.48,90.81 29.21,92.08 C5.2
N$29  (via drill 0.35)
  Top 0.305: R31.1 33.34,87.31 32.07,88.58 v31.43,88.58 27.94,88.58 27.62,88.9 27.62,90.17 U2.6 | v31.43,94.61 30.48,94.61 30.16,94.93 R32.2
  Bottom 0.305: v31.43,88.58 v31.43,94.61
N$30  (via drill 0.35)
  Top 0.305: v26.99,95.57 27.94,95.57 28.26,95.25 R32.1 28.26,94.93 29.53,93.66 46.35,93.66 v46.67,93.34 | v26.35,92.39 26.35,90.49 U2.7 | v47.94,14.61 47.94,7.3 R33.2
  Bottom 0.305: v26.99,95.57 26.35,94.93 v26.35,92.39 | v47.94,14.61 46.99,15.56 46.99,93.03 v46.67,93.34
N$31
  Top 0.305: R33.1 47.94,5.08 45.09,2.22 41.91,2.22 JACK-AUDIO_OUT.3_SIG
N$32
  Top 0.305: L1.2 37.15,25.4 37.15,23.5 32.38,23.5 31.43,22.54 31.43,20.95 32.7,20.95 36.2,17.46 JP2.2-OUT
N$33  (via drill 0.35)
  Top 0.305: v14.61,27.62 15.88,27.62 L2.1 | v20.95,18.73 20.64,18.41 8.57,18.41 6.35,16.19 6.03,16.19 D9.C
  Bottom 0.305: v14.61,27.62 18.1,27.62 18.1,26.67 21.59,23.18 21.59,19.37 v20.95,18.73
N$34
  Top 0.305: L3.1 11.75,16.19 14.92,16.19 D10.A
PIN2_LOOPGATE_CV  (via drill 0.35)
  Top 0.305: R3.2 32.7,2.86 31.75,3.81 v27.62,3.81 19.37,3.81 18.1,5.08 16.83,5.08 D2.3 | v22.86,63.5 22.23,63.5 21.59,62.87 R4.2
  Bottom 0.305: U$2.2 20,93.66 22.86,90.81 22.86,77.79 23.5,77.15 23.5,64.14 v22.86,63.5 24.13,62.23 24.13,52.7 25.4,51.44 25.4,35.88 24.13,34.61 24.13,28.57 27.62,25.08 v27.62,3.81
PIN3_TRIGGER_IN  (via drill 0.35)
  Top 0.305: R1.2 1.91,3.81 1.91,14.61 6.99,14.61 7.62,15.24 8.89,15.24 11.75,12.38 16.51,12.38 D1.3 16.83,12.38 19.05,14.61 23.81,14.61 25.08,15.88 v28.57,15.88 | v31.11,69.22 33.97,69.22 | 33.97,69.22 37.78,69.22 37.78,66.67 R2.2 | v22.54,76.83 v31.11,76.83 | 33.97,69.22 v33.97,66.36
  Bottom 0.305: v31.11,76.83 v31.11,69.22 | v22.54,76.83 22.23,77.15 22.23,88.9 20,91.12 U$2.3 | v28.57,15.88 30.48,17.78 30.48,44.45 32.7,46.67 32.7,53.66 35.24,56.2 35.24,65.09 v33.97,66.36
PIN4_LOOPTOGGLE  (via drill 0.35)
  Top 0.305: v17.78,74.61 17.78,68.58 16.19,66.99 15.56,66.99 15.24,67.31 13.65,67.31 13.02,66.67 8.26,66.67 8.26,65.09 C1.1 7.94,64.77 3.81,64.77 R5.1 3.81,64.45 v2.54,63.18 | v11.11,24.45 20.32,24.45 21.91,22.86 24.13,22.86 24.77,22.23 SUB_MINI-ON/ON.2
  Bottom 0.305: v17.78,74.61 17.46,74.93 17.46,85.41 17.14,85.72 17.14,86.36 19.68,88.9 U$2.4 | v11.11,24.45 2.54,33.02 v2.54,63.18
PIN_A1_PITCH_CV  (via drill 0.35)
  Top 0.305: v44.13,86.68 45.09,86.68 46.35,85.41 R27.1 | v41.91,94.61 40.96,95.57 31.43,95.57 30.16,96.84 22.23,96.84 20.64,95.25 v19.05,95.25 | v16.51,75.88 13.97,73.34 13.97,69.85 8.26,69.85 4.76,73.34 U$2.15/A1
  Bottom 0.305: v44.13,86.68 41.91,88.9 v41.91,94.61 | v19.05,95.25 16.51,92.71 v16.51,75.88
PIN_A2_PITCH_CV  (via drill 0.35)
  Top 0.305: v41.91,41.91 31.75,41.91 30.48,40.64 R10.1 | v42.55,54.29 41.91,54.93 41.27,54.93 40.01,56.2 40.01,59.37 v41.59,59.37 | D3.3 46.67,103.5 45.4,103.5 v44.77,102.87 39.05,102.87 v38.73,102.55 | v10.79,73.66 6.99,73.66 4.76,75.88 U$2.16/A2
  Bottom 0.305: v41.91,41.91 42.55,42.55 v42.55,54.29 | v41.59,59.37 43.18,60.96 43.18,76.2 45.09,78.11 45.09,95.57 44.77,95.89 v44.77,102.87 | v10.79,73.66 10.79,88.58 18.73,96.52 18.73,97.16 19.37,97.79 22.86,97.79 22.86,101.92 23.81,102.87 38.73,102.87 v38.73,102.55
PIN_A3_START_CV  (via drill 0.35)
  Top 0.305: v26.04,32.07 33.02,32.07 34.61,33.66 48.26,33.66 48.26,41.59 47.94,41.91 47.94,49.21 R28.1 | v26.04,27.94 25.08,26.99 18.73,26.99 18.41,26.67 12.38,26.67 v11.11,27.94
  Bottom 0.305: v26.04,27.94 v26.04,32.07 | v11.11,27.94 5.08,33.97 5.08,66.36 3.49,67.94 3.49,77.47 4.45,78.42 U$2.17/A3
PIN_A4_START_CV  (via drill 0.35)
  Top 0.305: v18.73,72.39 20.95,72.39 24.13,69.22 R14.1 24.45,68.9 25.4,67.94 27.94,67.94 v28.57,68.58 | v15.56,80.64 15.24,80.96 4.76,80.96 U$2.18/A4 | v33.02,60.96 43.5,60.96 46.99,57.47 D4.3
  Bottom 0.305: v18.73,72.39 15.56,75.56 v15.56,80.64 | v33.02,60.96 28.57,65.41 v28.57,68.58
PIN_A5_END_CV  (via drill 0.35)
  Top 0.305: v25.08,31.11 26.35,31.11 26.67,31.43 45.4,31.43 46.35,32.38 R29.1 | v26.35,39.37 23.5,42.23 13.02,42.23 12.7,42.55 10.79,42.55 10.48,42.23 v9.53,42.23
  Bottom 0.305: v25.08,31.11 25.08,34.61 26.35,35.88 v26.35,39.37 | v9.53,42.23 6.03,45.72 6.03,82.23 4.76,83.5 U$2.19/A5
PIN_A6_END_CV  (via drill 0.35)
  Top 0.305: 6.35,86.36 8.57,88.58 R19.1 | 6.35,86.36 4.76,86.36 U$2.20/A6 | v45.72,44.77 45.72,43.18 D5.3 | v43.5,52.07 41.27,54.29 40.01,54.29 v34.29,60.01 | v32.07,75.88 29.84,75.88 29.53,76.2 23.18,76.2 21.91,74.93 v19.05,74.93 | v18.1,86.04 17.78,86.36 6.35,86.36
  Bottom 0.305: v45.72,44.77 43.5,46.99 v43.5,52.07 | v34.29,60.01 33.97,60.33 33.97,65.09 32.07,66.99 32.07,74.3 31.75,74.61 31.75,75.56 v32.07,75.88 | v19.05,74.93 18.1,75.88 v18.1,86.04
PIN_A7_SAMPLE_CV
  Top 0.305: R30.1 46.35,78.42 38.73,86.04 32.38,86.04 31.11,87.31 25.72,87.31 25.4,87 22.54,87 20.64,85.09 4.13,85.09 3.49,85.72 3.49,88.58 4.45,88.58 U$2.21/A7
PIN_A8_SAMPLE_CV  (via drill 0.35)
  Top 0.305: D6.3 41.59,68.26 44.77,68.26 46.99,70.48 R24.1 46.99,70.8 46.67,70.8 v45.72,71.75 | v45.72,96.2 33.02,96.2 31.43,97.79 18.73,97.79 18.73,96.52 13.02,90.81 5.08,90.81 4.76,91.12 U$2.22/A8
  Bottom 0.305: v45.72,71.75 v45.72,96.2